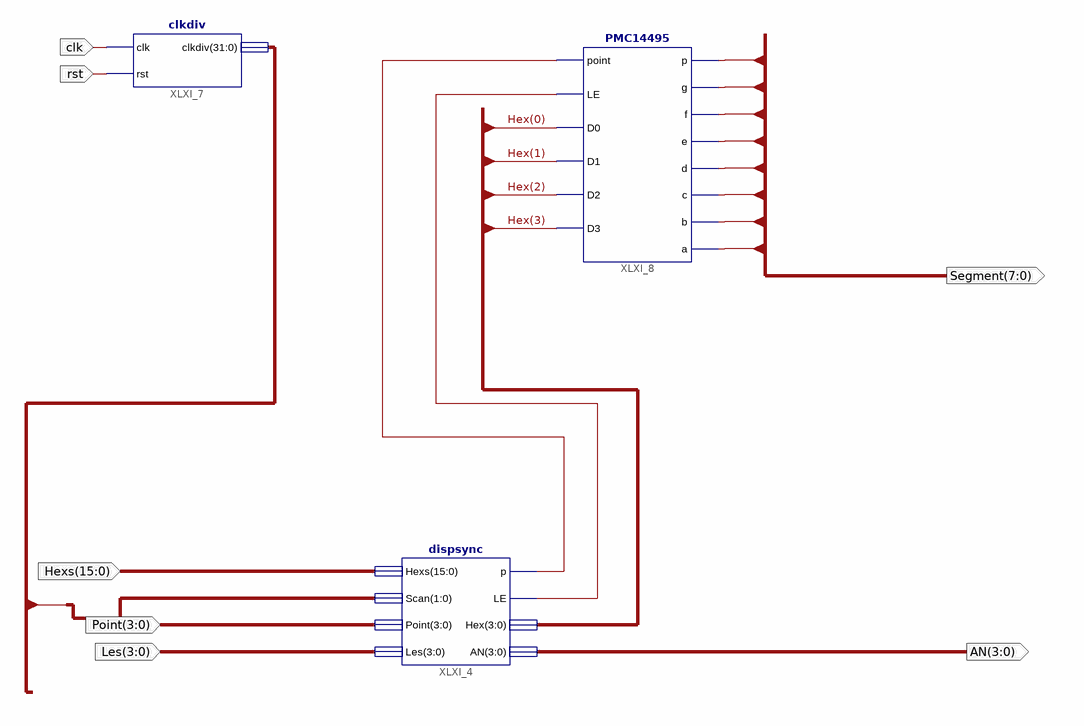
[diagram p0: schematic sheet 1]
// Xilinx ISE schematic disp_num.sch (kintex7) as structural Verilog: 3 symbols, 7 ports
module disp_num (
  input  clk,
  input  rst,
  input  [3:0] Les,
  input  [3:0] Point,
  input  [15:0] Hexs,
  output [7:0] Segment,
  output [3:0] AN
);

  wire XLXN_32, XLXN_34;
  wire [3:0] Hex;
  wire [31:0] clkdiv;

  clkdiv XLXI_7 (.clk(clk), .rst(rst), .clkdiv(clkdiv));
  PMC14495 XLXI_8 (
    .point(XLXN_32), .LE(XLXN_34), .D0(Hex[0]), .D1(Hex[1]), .D2(Hex[2]), .D3(Hex[3]), .p(Segment[7]),
    .g(Segment[6]), .f(Segment[5]), .e(Segment[4]), .d(Segment[3]), .c(Segment[2]), .b(Segment[1]),
    .a(Segment[0]));
  dispsync XLXI_4 (
    .Hexs(Hexs), .Scan(clkdiv[18:17]), .Point(Point), .Les(Les), .p(XLXN_32), .LE(XLXN_34), .Hex(Hex), .AN(AN));
endmodule
